# EAGLE design untitled (EAGLE 6.2)
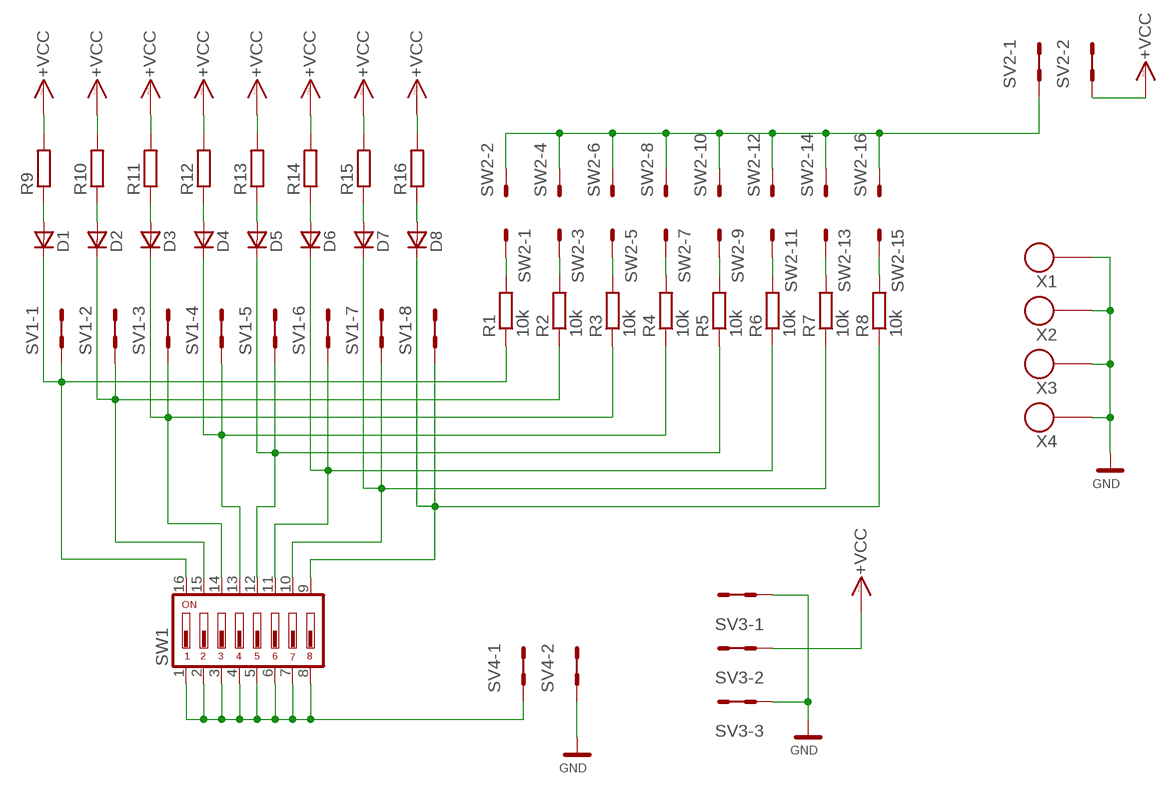
[diagram p0: schematic, sheet 1]

## Parts
D1  LED1206_2  [1206_2]
D2  LED1206_2  [1206_2]
D3  LED1206_2  [1206_2]
D4  LED1206_2  [1206_2]
D5  LED1206_2  [1206_2]
D6  LED1206_2  [1206_2]
D7  LED1206_2  [1206_2]
D8  LED1206_2  [1206_2]
R1  10k  R0805  [0805]
R2  10k  R0805  [0805]
R3  10k  R0805  [0805]
R4  10k  R0805  [0805]
R5  10k  R0805  [0805]
R6  10k  R0805  [0805]
R7  10k  R0805  [0805]
R8  10k  R0805  [0805]
R9  R0805  [0805]
R10  R0805  [0805]
R11  R0805  [0805]
R12  R0805  [0805]
R13  R0805  [0805]
R14  R0805  [0805]
R15  R0805  [0805]
R16  R0805  [0805]
SV1  MA08-2  [MA08-2]
SV2  MA02-2  [MA02-2]
SV3  MA03-2  [MA03-2]
SV4  MA02-2  [MA02-2]
SW1  DIP-08  [DIP08SW]
SW2  MA08-3  [MA08-2]
X1  SROUB3M  [SROUB3M]
X2  SROUB3M  [SROUB3M]
X3  SROUB3M  [SROUB3M]
X4  SROUB3M  [SROUB3M]

## Nets
GND: SV3.1 SV3.2 SV3.5 SV3.6 SV4.3 SV4.4 X1.P$1 X2.P$1 X3.P$1 X4.P$1
N$1: D1.K R1.1 SV1.1 SV1.2 SW1.16
N$2: D2.K R2.1 SV1.3 SV1.4 SW1.15
N$3: D3.K R3.1 SV1.5 SV1.6 SW1.14
N$4: D4.K R4.1 SV1.7 SV1.8 SW1.13
N$5: D5.K R5.1 SV1.9 SV1.10 SW1.12
N$6: D6.K R6.1 SV1.11 SV1.12 SW1.11
N$7: D7.K R7.1 SV1.13 SV1.14 SW1.10
N$8: D8.K R8.1 SV1.15 SV1.16 SW1.9
N$9: R1.2 SW2.1
N$10: R2.2 SW2.3
N$11: R3.2 SW2.5
N$12: R4.2 SW2.7
N$13: R5.2 SW2.9
N$14: R6.2 SW2.11
N$15: R7.2 SW2.13
N$16: R8.2 SW2.15
N$17: D2.A R10.1
N$18: D3.A R11.1
N$19: D4.A R12.1
N$20: SV2.1 SV2.2 SW2.2 SW2.4 SW2.6 SW2.8 SW2.10 SW2.12 SW2.14 SW2.16
N$21: D5.A R13.1
N$22: SV4.1 SV4.2 SW1.1 SW1.2 SW1.3 SW1.4 SW1.5 SW1.6 SW1.7 SW1.8
N$23: D6.A R14.1
N$24: D7.A R15.1
N$25: D1.A R9.1
N$26: D8.A R16.1
VCC: R9.2 R10.2 R11.2 R12.2 R13.2 R14.2 R15.2 R16.2 SV2.3 SV2.4 SV3.3 SV3.4 ; supply symbol labelled +VCC

## Library data of the parts
D1-D8 = moje_diody:LED1206_2
R1-R16 = moje_R:R0805
SV1 = moje_hrebinky:MA08-2: PIN HEADER; OC_FARNELL: unknown; OC_NEWARK: unknown
SV2 SV4 = moje_hrebinky:MA02-2
SV3 = moje_hrebinky:MA03-2: PIN HEADER; OC_FARNELL: unknown; OC_NEWARK: unknown
SW1 = moje_tlacitka:DIP-08
SW2 = moje_hrebinky:MA08-3
X1-X4 = moje:SROUB3M

## Board
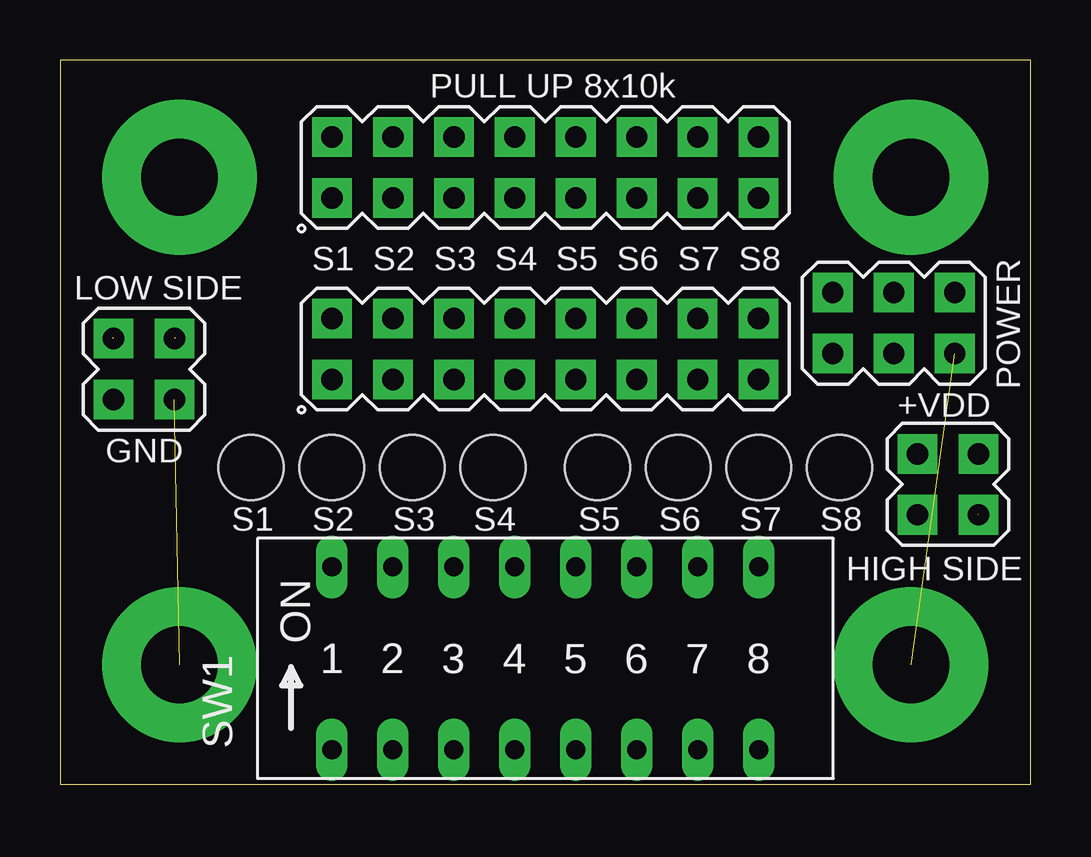
[diagram p1: board, top side]
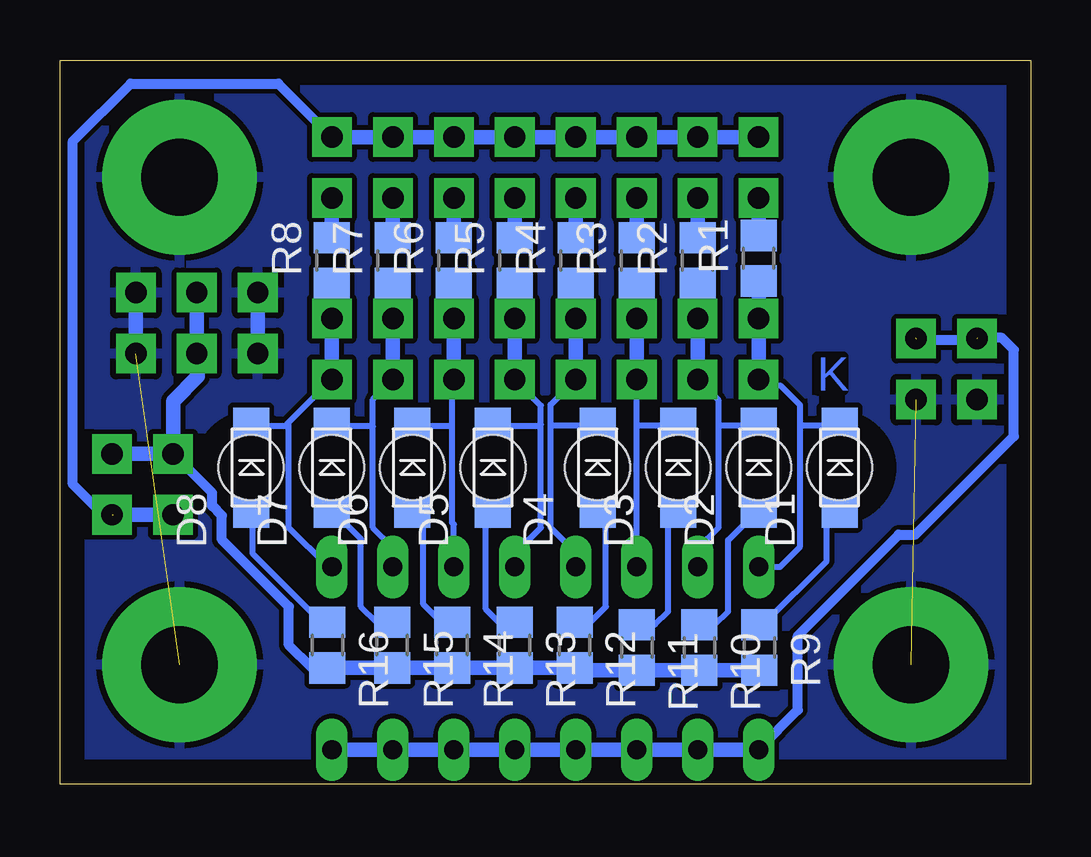
[diagram p2: board, bottom side, seen from below]

Size 40.44 x 30.18 mm. Coordinates in mm from the lower left corner, seen from the top.
Outline: 0,0 40.44,0 40.44,30.18 0,30.18 0,0
Copper layers (1*16): Top 0.035mm / dielectric 1.5mm / Bottom 0.035mm
Design rules: minimum track width 10mil, minimum drill 24mil, track to track 8mil, track to pad 8mil, pad to pad 8mil, via to via 8mil, smd to smd 8mil, copper to edge 40mil, drill to drill 8mil, minimum pad ring 10mil, minimum via ring 8mil, stop-mask expansion 4mil, vias tented up to drill 0mil, thermal gap 10mil

### Footprints (pad centres in the part's own frame; a part is rotated, then mirrored left to right if it is on the bottom)
1206_2 = smd 1.5 x 1.5: A 0,-1.75; K 0,1.75 | hole 2.7: 0,0
0805 = smd 1.3 x 1.5: 1 -0.95,0; 2 0.95,0
MA08-2 = drill 0.889 pad 1.651 square: 1 -8.89,-1.27; 2 -8.89,1.27; 3 -6.35,-1.27; 4 -6.35,1.27; 5 -3.81,-1.27; 6 -3.81,1.27; 7 -1.27,-1.27; 8 -1.27,1.27; 9 1.27,-1.27; 10 1.27,1.27; 11 3.81,-1.27; 12 3.81,1.27; 13 6.35,-1.27; 14 6.35,1.27; 15 8.89,-1.27; 16 8.89,1.27
MA02-2 = drill 0.889 pad 1.651 square: 1 -1.27,-1.27; 2 -1.27,1.27; 3 1.27,-1.27; 4 1.27,1.27
MA03-2 = drill 0.889 pad 1.651 square: 1 -2.54,-1.27; 2 -2.54,1.27; 3 0,-1.27; 4 0,1.27; 5 2.54,-1.27; 6 2.54,1.27
DIP08SW = drill 0.8 long: 1 -8.89,-3.81; 2 -6.35,-3.81; 3 -3.81,-3.81; 4 -1.27,-3.81; 5 1.27,-3.81; 6 3.81,-3.81; 7 6.35,-3.81; 8 8.89,-3.81; 9 8.89,3.81; 10 6.35,3.81; 11 3.81,3.81; 12 1.27,3.81; 13 -1.27,3.81; 14 -3.81,3.81; 15 -6.35,3.81; 16 -8.89,3.81
SROUB3M = drill 3.2 pad 6.452: P$1 0,0

### Placement (x,y rotation side)
D1  7.96,13.2 0 bottom
D2  11.32,13.2 0 bottom
D3  14.68,13.2 0 bottom
D4  18.04,13.2 0 bottom
D5  22.4,13.2 0 bottom
D6  25.76,13.2 0 bottom
D7  29.12,13.2 0 bottom
D8  32.48,13.2 0 bottom
R1  11.33,21.92 90 bottom
R2  13.87,21.82 90 bottom
R3  16.41,21.82 90 bottom
R4  18.95,21.82 90 bottom
R5  21.49,21.82 90 bottom
R6  24.03,21.82 90 bottom
R7  26.57,21.82 90 bottom
R8  29.11,21.82 90 bottom
R9  11.3,5.7 270 bottom
R10  13.8,5.7 270 bottom
R11  16.4,5.7 270 bottom
R12  19,5.8 270 bottom
R13  21.5,5.8 270 bottom
R14  24.1,5.8 270 bottom
R15  26.6,5.8 270 bottom
R16  29.3,5.8 270 bottom
SV1  20.22,18.14 0 top
SV2  37,12.5 90 top
SV3  34.74,19.22 0 top
SV4  3.5,17.3 270 top
SW1  20.22,5.25 0 top
SW2  20.22,25.7 0 top
X1  4.98,4.98 0 top
X2  4.98,25.3 0 top
X3  35.46,25.3 0 top
X4  35.46,4.98 0 top

### Tracks (layer width: path | path; a pad name or v marks a point on that pad's centre or on a via)
GND  (2 unrouted)
  Bottom 0.61: SV3.5 SV3.6 | SV3.1 SV3.2
  pour Bottom: 0.1,0.2 40.7,0.2 40.7,30 0,30 0,0.1
N$1
  Bottom 0.254: SW1.16 10.44,9.06 9.6,9.9 9.6,15 | 9.6,15 9.6,15.8 10.4,16.6 11.06,16.6 SV1.1 | D1.K 9.55,14.95 9.6,15
  Bottom 0.61: SV1.1 SV1.2 R1.1
N$2
  Bottom 0.254: SW1.15 13.87,9.83 13,10.7 13,14.9 | 13,14.9 13,16 SV1.3 | D2.K 12.95,14.95 13,14.9
  Bottom 0.61: SV1.3 SV1.4 R2.1
N$3
  Bottom 0.254: SW1.14 16.41,15 | 16.41,15 SV1.5 | D3.K 16.36,14.95 16.41,15
  Bottom 0.61: SV1.5 SV1.6 R3.1
N$4
  Bottom 0.254: SW1.13 18.95,9.65 20,10.7 20,15 | 20,15 20,15.82 SV1.7 | D4.K 19.95,14.95 20,15
  Bottom 0.61: SV1.7 SV1.8 R4.1
N$5
  Bottom 0.254: SW1.12 21.49,9.61 20.4,10.7 20.4,15 | 20.4,15 20.4,15.78 SV1.9 | D5.K 20.45,14.95 20.4,15
  Bottom 0.61: SV1.9 SV1.10 R5.1
N$6
  Bottom 0.254: SW1.11 24.03,10.83 24.1,10.9 24.1,14.9 | 24.1,14.9 24.1,16.8 SV1.11 | D6.K 24.15,14.95 24.1,14.9
  Bottom 0.61: SV1.11 SV1.12 R6.1
N$7
  Bottom 0.254: SW1.10 26.57,9.87 27.4,10.7 27.4,14.9 | 27.4,14.9 27.4,16.04 SV1.13 | D7.K 27.45,14.95 27.4,14.9
  Bottom 0.61: SV1.13 SV1.14 R7.1
N$8
  Bottom 0.254: SW1.9 29.26,9.06 30.9,10.7 30.9,15.08 | 30.9,15.08 SV1.15 | D8.K 31.03,14.95 30.9,15.08
  Bottom 0.61: SV1.15 SV1.16 R8.1
N$9
  Bottom 0.61: R1.2 SW2.1
N$10
  Bottom 0.61: R2.2 SW2.3
N$11
  Bottom 0.61: R3.2 SW2.5
N$12
  Bottom 0.61: R4.2 SW2.7
N$13
  Bottom 0.61: R5.2 SW2.9
N$14
  Bottom 0.61: R6.2 SW2.11
N$15
  Bottom 0.61: R7.2 SW2.13
N$16
  Bottom 0.61: R8.2 SW2.15
N$17
  Bottom 0.254: R10.1 13.15,6.65 12.6,7.2 12.6,10.17 D2.A
N$18
  Bottom 0.254: R11.1 15.65,6.65 15.1,7.2 15.1,11.03 D3.A
N$19
  Bottom 0.254: R12.1 18.35,6.75 17.7,7.4 17.7,11.11 D4.A
N$20  (1 unrouted)
  Bottom 0.406: SV2.1 38.63,11.23 39.9,12.5 39.9,26.8 37.5,29.2 31.34,29.2 SW2.16
  Bottom 0.61: SW2.2 SW2.4 SW2.6 SW2.8 SW2.10 SW2.12 SW2.14 SW2.16 | SV2.2 38.23,11.23 38.3,11.3
N$21
  Bottom 0.254: R13.1 22.15,6.75 22.7,7.3 22.7,11.15 D5.A
N$22  (2 unrouted)
  Bottom 0.406: SW1.1 11.33,1.47 9.7,3.1 9.7,6.2 5.5,10.4 4.8,10.4 0.7,14.5 0.7,18.1 1.2,18.6 2.2,18.6 2.3,18.5 | 2.3,18.5 2.2,18.5 | 2.3,18.5 4.7,18.5 4.8,18.6
  Bottom 0.61: SW1.1 SW1.2 SW1.3 SW1.4 SW1.5 SW1.6 SW1.7 SW1.8
N$23
  Bottom 0.254: R14.1 24.55,6.75 25.3,7.5 25.3,10.99 D6.A
N$24
  Bottom 0.254: R15.1 27.25,6.75 27.9,7.4 27.9,10.23 D7.A
N$25
  Bottom 0.254: R9.1 11.15,6.65 8.5,9.3 8.5,10.91 D1.A
N$26
  Bottom 0.254: R16.1 29.55,6.75 32.4,9.6 32.4,11.37 D8.A
VCC
  Bottom 0.406: 18.9,4.75 R12.2 | R16.2 29.95,4.85 30.9,5.8 30.9,7.4 33.7,10.2 33.7,11.2 34.1,11.6 34.1,12.14 SV2.4
  Bottom 0.61: R9.2 R10.2 R11.2 18.9,4.75 | R12.2 R13.2 R14.2 R15.2 R16.2 | SV3.4 SV3.3 34.7,17.91 34.7,17 35.73,15.97 SV2.4 SV2.3 38.3,13.8

### Text on the board
Bottom: K
tPlace: PULL UP 8x10k | S1 | S2 | S3 | S4 | S5 | S6 | S7 | S8 | POWER | LOW SIDE | +VDD | GND | S1 | S2 | S3 | S4 | S5 | S6 | S7 | S8 | HIGH SIDE